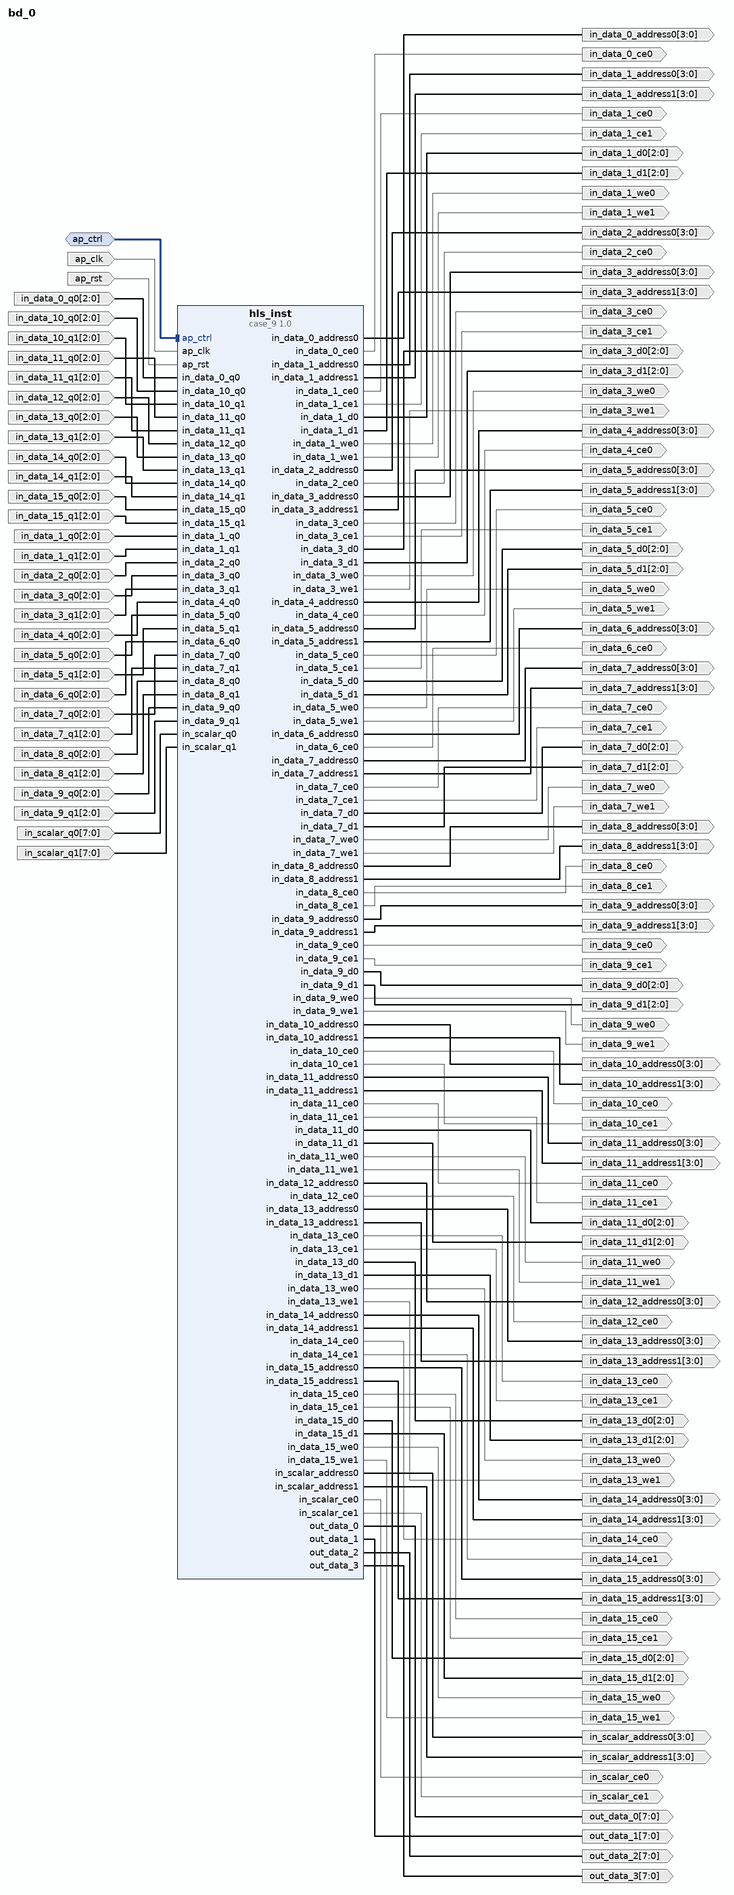
[diagram p0: block diagram of the top level]
# Vivado block design bd_0, xc7z020clg484-1, Vivado 2025.1
create_bd_design bd_0

create_bd_intf_port -mode Slave -vlnv xilinx.com:interface:acc_handshake_rtl:1.0 ap_ctrl
create_bd_port -dir I -type clk ap_clk
set_property -dict {CONFIG.FREQ_HZ 83000000.0} [get_bd_ports ap_clk]
create_bd_port -dir I -type rst ap_rst
set_property -dict {CONFIG.POLARITY ACTIVE_HIGH} [get_bd_ports ap_rst]
create_bd_port -dir O -from 3 -to 0 -type data in_data_0_address0
create_bd_port -dir O in_data_0_ce0
create_bd_port -dir I -from 2 -to 0 -type data in_data_0_q0
create_bd_port -dir O -from 3 -to 0 -type data in_data_10_address0
create_bd_port -dir O -from 3 -to 0 -type data in_data_10_address1
create_bd_port -dir O in_data_10_ce0
create_bd_port -dir O in_data_10_ce1
create_bd_port -dir I -from 2 -to 0 -type data in_data_10_q0
create_bd_port -dir I -from 2 -to 0 -type data in_data_10_q1
create_bd_port -dir O -from 3 -to 0 -type data in_data_11_address0
create_bd_port -dir O -from 3 -to 0 -type data in_data_11_address1
create_bd_port -dir O in_data_11_ce0
create_bd_port -dir O in_data_11_ce1
create_bd_port -dir O -from 2 -to 0 -type data in_data_11_d0
create_bd_port -dir O -from 2 -to 0 -type data in_data_11_d1
create_bd_port -dir I -from 2 -to 0 -type data in_data_11_q0
create_bd_port -dir I -from 2 -to 0 -type data in_data_11_q1
create_bd_port -dir O in_data_11_we0
create_bd_port -dir O in_data_11_we1
create_bd_port -dir O -from 3 -to 0 -type data in_data_12_address0
create_bd_port -dir O in_data_12_ce0
create_bd_port -dir I -from 2 -to 0 -type data in_data_12_q0
create_bd_port -dir O -from 3 -to 0 -type data in_data_13_address0
create_bd_port -dir O -from 3 -to 0 -type data in_data_13_address1
create_bd_port -dir O in_data_13_ce0
create_bd_port -dir O in_data_13_ce1
create_bd_port -dir O -from 2 -to 0 -type data in_data_13_d0
create_bd_port -dir O -from 2 -to 0 -type data in_data_13_d1
create_bd_port -dir I -from 2 -to 0 -type data in_data_13_q0
create_bd_port -dir I -from 2 -to 0 -type data in_data_13_q1
create_bd_port -dir O in_data_13_we0
create_bd_port -dir O in_data_13_we1
create_bd_port -dir O -from 3 -to 0 -type data in_data_14_address0
create_bd_port -dir O -from 3 -to 0 -type data in_data_14_address1
create_bd_port -dir O in_data_14_ce0
create_bd_port -dir O in_data_14_ce1
create_bd_port -dir I -from 2 -to 0 -type data in_data_14_q0
create_bd_port -dir I -from 2 -to 0 -type data in_data_14_q1
create_bd_port -dir O -from 3 -to 0 -type data in_data_15_address0
create_bd_port -dir O -from 3 -to 0 -type data in_data_15_address1
create_bd_port -dir O in_data_15_ce0
create_bd_port -dir O in_data_15_ce1
create_bd_port -dir O -from 2 -to 0 -type data in_data_15_d0
create_bd_port -dir O -from 2 -to 0 -type data in_data_15_d1
create_bd_port -dir I -from 2 -to 0 -type data in_data_15_q0
create_bd_port -dir I -from 2 -to 0 -type data in_data_15_q1
create_bd_port -dir O in_data_15_we0
create_bd_port -dir O in_data_15_we1
create_bd_port -dir O -from 3 -to 0 -type data in_data_1_address0
create_bd_port -dir O -from 3 -to 0 -type data in_data_1_address1
create_bd_port -dir O in_data_1_ce0
create_bd_port -dir O in_data_1_ce1
create_bd_port -dir O -from 2 -to 0 -type data in_data_1_d0
create_bd_port -dir O -from 2 -to 0 -type data in_data_1_d1
create_bd_port -dir I -from 2 -to 0 -type data in_data_1_q0
create_bd_port -dir I -from 2 -to 0 -type data in_data_1_q1
create_bd_port -dir O in_data_1_we0
create_bd_port -dir O in_data_1_we1
create_bd_port -dir O -from 3 -to 0 -type data in_data_2_address0
create_bd_port -dir O in_data_2_ce0
create_bd_port -dir I -from 2 -to 0 -type data in_data_2_q0
create_bd_port -dir O -from 3 -to 0 -type data in_data_3_address0
create_bd_port -dir O -from 3 -to 0 -type data in_data_3_address1
create_bd_port -dir O in_data_3_ce0
create_bd_port -dir O in_data_3_ce1
create_bd_port -dir O -from 2 -to 0 -type data in_data_3_d0
create_bd_port -dir O -from 2 -to 0 -type data in_data_3_d1
create_bd_port -dir I -from 2 -to 0 -type data in_data_3_q0
create_bd_port -dir I -from 2 -to 0 -type data in_data_3_q1
create_bd_port -dir O in_data_3_we0
create_bd_port -dir O in_data_3_we1
create_bd_port -dir O -from 3 -to 0 -type data in_data_4_address0
create_bd_port -dir O in_data_4_ce0
create_bd_port -dir I -from 2 -to 0 -type data in_data_4_q0
create_bd_port -dir O -from 3 -to 0 -type data in_data_5_address0
create_bd_port -dir O -from 3 -to 0 -type data in_data_5_address1
create_bd_port -dir O in_data_5_ce0
create_bd_port -dir O in_data_5_ce1
create_bd_port -dir O -from 2 -to 0 -type data in_data_5_d0
create_bd_port -dir O -from 2 -to 0 -type data in_data_5_d1
create_bd_port -dir I -from 2 -to 0 -type data in_data_5_q0
create_bd_port -dir I -from 2 -to 0 -type data in_data_5_q1
create_bd_port -dir O in_data_5_we0
create_bd_port -dir O in_data_5_we1
create_bd_port -dir O -from 3 -to 0 -type data in_data_6_address0
create_bd_port -dir O in_data_6_ce0
create_bd_port -dir I -from 2 -to 0 -type data in_data_6_q0
create_bd_port -dir O -from 3 -to 0 -type data in_data_7_address0
create_bd_port -dir O -from 3 -to 0 -type data in_data_7_address1
create_bd_port -dir O in_data_7_ce0
create_bd_port -dir O in_data_7_ce1
create_bd_port -dir O -from 2 -to 0 -type data in_data_7_d0
create_bd_port -dir O -from 2 -to 0 -type data in_data_7_d1
create_bd_port -dir I -from 2 -to 0 -type data in_data_7_q0
create_bd_port -dir I -from 2 -to 0 -type data in_data_7_q1
create_bd_port -dir O in_data_7_we0
create_bd_port -dir O in_data_7_we1
create_bd_port -dir O -from 3 -to 0 -type data in_data_8_address0
create_bd_port -dir O -from 3 -to 0 -type data in_data_8_address1
create_bd_port -dir O in_data_8_ce0
create_bd_port -dir O in_data_8_ce1
create_bd_port -dir I -from 2 -to 0 -type data in_data_8_q0
create_bd_port -dir I -from 2 -to 0 -type data in_data_8_q1
create_bd_port -dir O -from 3 -to 0 -type data in_data_9_address0
create_bd_port -dir O -from 3 -to 0 -type data in_data_9_address1
create_bd_port -dir O in_data_9_ce0
create_bd_port -dir O in_data_9_ce1
create_bd_port -dir O -from 2 -to 0 -type data in_data_9_d0
create_bd_port -dir O -from 2 -to 0 -type data in_data_9_d1
create_bd_port -dir I -from 2 -to 0 -type data in_data_9_q0
create_bd_port -dir I -from 2 -to 0 -type data in_data_9_q1
create_bd_port -dir O in_data_9_we0
create_bd_port -dir O in_data_9_we1
create_bd_port -dir O -from 3 -to 0 -type data in_scalar_address0
create_bd_port -dir O -from 3 -to 0 -type data in_scalar_address1
create_bd_port -dir O in_scalar_ce0
create_bd_port -dir O in_scalar_ce1
create_bd_port -dir I -from 7 -to 0 -type data in_scalar_q0
create_bd_port -dir I -from 7 -to 0 -type data in_scalar_q1
create_bd_port -dir O -from 7 -to 0 -type data out_data_0
create_bd_port -dir O -from 7 -to 0 -type data out_data_1
create_bd_port -dir O -from 7 -to 0 -type data out_data_2
create_bd_port -dir O -from 7 -to 0 -type data out_data_3

create_bd_cell -type ip -vlnv xilinx.com:hls:case_9:1.0 hls_inst

# ---- connections ----

connect_bd_intf_net -intf_net ap_ctrl_0_1 [get_bd_intf_ports ap_ctrl] [get_bd_intf_pins hls_inst/ap_ctrl]
connect_bd_net -net ap_clk_0_1 [get_bd_ports ap_clk] [get_bd_pins hls_inst/ap_clk]
connect_bd_net -net ap_rst_0_1 [get_bd_ports ap_rst] [get_bd_pins hls_inst/ap_rst]
connect_bd_net [get_bd_pins hls_inst/in_data_0_address0] [get_bd_ports in_data_0_address0]
connect_bd_net [get_bd_pins hls_inst/in_data_0_ce0] [get_bd_ports in_data_0_ce0]
connect_bd_net [get_bd_pins hls_inst/in_data_10_address0] [get_bd_ports in_data_10_address0]
connect_bd_net [get_bd_pins hls_inst/in_data_10_address1] [get_bd_ports in_data_10_address1]
connect_bd_net [get_bd_pins hls_inst/in_data_10_ce0] [get_bd_ports in_data_10_ce0]
connect_bd_net [get_bd_pins hls_inst/in_data_10_ce1] [get_bd_ports in_data_10_ce1]
connect_bd_net [get_bd_pins hls_inst/in_data_11_address0] [get_bd_ports in_data_11_address0]
connect_bd_net [get_bd_pins hls_inst/in_data_11_address1] [get_bd_ports in_data_11_address1]
connect_bd_net [get_bd_pins hls_inst/in_data_11_ce0] [get_bd_ports in_data_11_ce0]
connect_bd_net [get_bd_pins hls_inst/in_data_11_ce1] [get_bd_ports in_data_11_ce1]
connect_bd_net [get_bd_pins hls_inst/in_data_11_d0] [get_bd_ports in_data_11_d0]
connect_bd_net [get_bd_pins hls_inst/in_data_11_d1] [get_bd_ports in_data_11_d1]
connect_bd_net [get_bd_pins hls_inst/in_data_11_we0] [get_bd_ports in_data_11_we0]
connect_bd_net [get_bd_pins hls_inst/in_data_11_we1] [get_bd_ports in_data_11_we1]
connect_bd_net [get_bd_pins hls_inst/in_data_12_address0] [get_bd_ports in_data_12_address0]
connect_bd_net [get_bd_pins hls_inst/in_data_12_ce0] [get_bd_ports in_data_12_ce0]
connect_bd_net [get_bd_pins hls_inst/in_data_13_address0] [get_bd_ports in_data_13_address0]
connect_bd_net [get_bd_pins hls_inst/in_data_13_address1] [get_bd_ports in_data_13_address1]
connect_bd_net [get_bd_pins hls_inst/in_data_13_ce0] [get_bd_ports in_data_13_ce0]
connect_bd_net [get_bd_pins hls_inst/in_data_13_ce1] [get_bd_ports in_data_13_ce1]
connect_bd_net [get_bd_pins hls_inst/in_data_13_d0] [get_bd_ports in_data_13_d0]
connect_bd_net [get_bd_pins hls_inst/in_data_13_d1] [get_bd_ports in_data_13_d1]
connect_bd_net [get_bd_pins hls_inst/in_data_13_we0] [get_bd_ports in_data_13_we0]
connect_bd_net [get_bd_pins hls_inst/in_data_13_we1] [get_bd_ports in_data_13_we1]
connect_bd_net [get_bd_pins hls_inst/in_data_14_address0] [get_bd_ports in_data_14_address0]
connect_bd_net [get_bd_pins hls_inst/in_data_14_address1] [get_bd_ports in_data_14_address1]
connect_bd_net [get_bd_pins hls_inst/in_data_14_ce0] [get_bd_ports in_data_14_ce0]
connect_bd_net [get_bd_pins hls_inst/in_data_14_ce1] [get_bd_ports in_data_14_ce1]
connect_bd_net [get_bd_pins hls_inst/in_data_15_address0] [get_bd_ports in_data_15_address0]
connect_bd_net [get_bd_pins hls_inst/in_data_15_address1] [get_bd_ports in_data_15_address1]
connect_bd_net [get_bd_pins hls_inst/in_data_15_ce0] [get_bd_ports in_data_15_ce0]
connect_bd_net [get_bd_pins hls_inst/in_data_15_ce1] [get_bd_ports in_data_15_ce1]
connect_bd_net [get_bd_pins hls_inst/in_data_15_d0] [get_bd_ports in_data_15_d0]
connect_bd_net [get_bd_pins hls_inst/in_data_15_d1] [get_bd_ports in_data_15_d1]
connect_bd_net [get_bd_pins hls_inst/in_data_15_we0] [get_bd_ports in_data_15_we0]
connect_bd_net [get_bd_pins hls_inst/in_data_15_we1] [get_bd_ports in_data_15_we1]
connect_bd_net [get_bd_pins hls_inst/in_data_1_address0] [get_bd_ports in_data_1_address0]
connect_bd_net [get_bd_pins hls_inst/in_data_1_address1] [get_bd_ports in_data_1_address1]
connect_bd_net [get_bd_pins hls_inst/in_data_1_ce0] [get_bd_ports in_data_1_ce0]
connect_bd_net [get_bd_pins hls_inst/in_data_1_ce1] [get_bd_ports in_data_1_ce1]
connect_bd_net [get_bd_pins hls_inst/in_data_1_d0] [get_bd_ports in_data_1_d0]
connect_bd_net [get_bd_pins hls_inst/in_data_1_d1] [get_bd_ports in_data_1_d1]
connect_bd_net [get_bd_pins hls_inst/in_data_1_we0] [get_bd_ports in_data_1_we0]
connect_bd_net [get_bd_pins hls_inst/in_data_1_we1] [get_bd_ports in_data_1_we1]
connect_bd_net [get_bd_pins hls_inst/in_data_2_address0] [get_bd_ports in_data_2_address0]
connect_bd_net [get_bd_pins hls_inst/in_data_2_ce0] [get_bd_ports in_data_2_ce0]
connect_bd_net [get_bd_pins hls_inst/in_data_3_address0] [get_bd_ports in_data_3_address0]
connect_bd_net [get_bd_pins hls_inst/in_data_3_address1] [get_bd_ports in_data_3_address1]
connect_bd_net [get_bd_pins hls_inst/in_data_3_ce0] [get_bd_ports in_data_3_ce0]
connect_bd_net [get_bd_pins hls_inst/in_data_3_ce1] [get_bd_ports in_data_3_ce1]
connect_bd_net [get_bd_pins hls_inst/in_data_3_d0] [get_bd_ports in_data_3_d0]
connect_bd_net [get_bd_pins hls_inst/in_data_3_d1] [get_bd_ports in_data_3_d1]
connect_bd_net [get_bd_pins hls_inst/in_data_3_we0] [get_bd_ports in_data_3_we0]
connect_bd_net [get_bd_pins hls_inst/in_data_3_we1] [get_bd_ports in_data_3_we1]
connect_bd_net [get_bd_pins hls_inst/in_data_4_address0] [get_bd_ports in_data_4_address0]
connect_bd_net [get_bd_pins hls_inst/in_data_4_ce0] [get_bd_ports in_data_4_ce0]
connect_bd_net [get_bd_pins hls_inst/in_data_5_address0] [get_bd_ports in_data_5_address0]
connect_bd_net [get_bd_pins hls_inst/in_data_5_address1] [get_bd_ports in_data_5_address1]
connect_bd_net [get_bd_pins hls_inst/in_data_5_ce0] [get_bd_ports in_data_5_ce0]
connect_bd_net [get_bd_pins hls_inst/in_data_5_ce1] [get_bd_ports in_data_5_ce1]
connect_bd_net [get_bd_pins hls_inst/in_data_5_d0] [get_bd_ports in_data_5_d0]
connect_bd_net [get_bd_pins hls_inst/in_data_5_d1] [get_bd_ports in_data_5_d1]
connect_bd_net [get_bd_pins hls_inst/in_data_5_we0] [get_bd_ports in_data_5_we0]
connect_bd_net [get_bd_pins hls_inst/in_data_5_we1] [get_bd_ports in_data_5_we1]
connect_bd_net [get_bd_pins hls_inst/in_data_6_address0] [get_bd_ports in_data_6_address0]
connect_bd_net [get_bd_pins hls_inst/in_data_6_ce0] [get_bd_ports in_data_6_ce0]
connect_bd_net [get_bd_pins hls_inst/in_data_7_address0] [get_bd_ports in_data_7_address0]
connect_bd_net [get_bd_pins hls_inst/in_data_7_address1] [get_bd_ports in_data_7_address1]
connect_bd_net [get_bd_pins hls_inst/in_data_7_ce0] [get_bd_ports in_data_7_ce0]
connect_bd_net [get_bd_pins hls_inst/in_data_7_ce1] [get_bd_ports in_data_7_ce1]
connect_bd_net [get_bd_pins hls_inst/in_data_7_d0] [get_bd_ports in_data_7_d0]
connect_bd_net [get_bd_pins hls_inst/in_data_7_d1] [get_bd_ports in_data_7_d1]
connect_bd_net [get_bd_pins hls_inst/in_data_7_we0] [get_bd_ports in_data_7_we0]
connect_bd_net [get_bd_pins hls_inst/in_data_7_we1] [get_bd_ports in_data_7_we1]
connect_bd_net [get_bd_pins hls_inst/in_data_8_address0] [get_bd_ports in_data_8_address0]
connect_bd_net [get_bd_pins hls_inst/in_data_8_address1] [get_bd_ports in_data_8_address1]
connect_bd_net [get_bd_pins hls_inst/in_data_8_ce0] [get_bd_ports in_data_8_ce0]
connect_bd_net [get_bd_pins hls_inst/in_data_8_ce1] [get_bd_ports in_data_8_ce1]
connect_bd_net [get_bd_pins hls_inst/in_data_9_address0] [get_bd_ports in_data_9_address0]
connect_bd_net [get_bd_pins hls_inst/in_data_9_address1] [get_bd_ports in_data_9_address1]
connect_bd_net [get_bd_pins hls_inst/in_data_9_ce0] [get_bd_ports in_data_9_ce0]
connect_bd_net [get_bd_pins hls_inst/in_data_9_ce1] [get_bd_ports in_data_9_ce1]
connect_bd_net [get_bd_pins hls_inst/in_data_9_d0] [get_bd_ports in_data_9_d0]
connect_bd_net [get_bd_pins hls_inst/in_data_9_d1] [get_bd_ports in_data_9_d1]
connect_bd_net [get_bd_pins hls_inst/in_data_9_we0] [get_bd_ports in_data_9_we0]
connect_bd_net [get_bd_pins hls_inst/in_data_9_we1] [get_bd_ports in_data_9_we1]
connect_bd_net [get_bd_pins hls_inst/in_scalar_address0] [get_bd_ports in_scalar_address0]
connect_bd_net [get_bd_pins hls_inst/in_scalar_address1] [get_bd_ports in_scalar_address1]
connect_bd_net [get_bd_pins hls_inst/in_scalar_ce0] [get_bd_ports in_scalar_ce0]
connect_bd_net [get_bd_pins hls_inst/in_scalar_ce1] [get_bd_ports in_scalar_ce1]
connect_bd_net [get_bd_pins hls_inst/out_data_0] [get_bd_ports out_data_0]
connect_bd_net [get_bd_pins hls_inst/out_data_1] [get_bd_ports out_data_1]
connect_bd_net [get_bd_pins hls_inst/out_data_2] [get_bd_ports out_data_2]
connect_bd_net [get_bd_pins hls_inst/out_data_3] [get_bd_ports out_data_3]
connect_bd_net -net in_data_0_q0_0_1 [get_bd_ports in_data_0_q0] [get_bd_pins hls_inst/in_data_0_q0]
connect_bd_net -net in_data_10_q0_0_1 [get_bd_ports in_data_10_q0] [get_bd_pins hls_inst/in_data_10_q0]
connect_bd_net -net in_data_10_q1_0_1 [get_bd_ports in_data_10_q1] [get_bd_pins hls_inst/in_data_10_q1]
connect_bd_net -net in_data_11_q0_0_1 [get_bd_ports in_data_11_q0] [get_bd_pins hls_inst/in_data_11_q0]
connect_bd_net -net in_data_11_q1_0_1 [get_bd_ports in_data_11_q1] [get_bd_pins hls_inst/in_data_11_q1]
connect_bd_net -net in_data_12_q0_0_1 [get_bd_ports in_data_12_q0] [get_bd_pins hls_inst/in_data_12_q0]
connect_bd_net -net in_data_13_q0_0_1 [get_bd_ports in_data_13_q0] [get_bd_pins hls_inst/in_data_13_q0]
connect_bd_net -net in_data_13_q1_0_1 [get_bd_ports in_data_13_q1] [get_bd_pins hls_inst/in_data_13_q1]
connect_bd_net -net in_data_14_q0_0_1 [get_bd_ports in_data_14_q0] [get_bd_pins hls_inst/in_data_14_q0]
connect_bd_net -net in_data_14_q1_0_1 [get_bd_ports in_data_14_q1] [get_bd_pins hls_inst/in_data_14_q1]
connect_bd_net -net in_data_15_q0_0_1 [get_bd_ports in_data_15_q0] [get_bd_pins hls_inst/in_data_15_q0]
connect_bd_net -net in_data_15_q1_0_1 [get_bd_ports in_data_15_q1] [get_bd_pins hls_inst/in_data_15_q1]
connect_bd_net -net in_data_1_q0_0_1 [get_bd_ports in_data_1_q0] [get_bd_pins hls_inst/in_data_1_q0]
connect_bd_net -net in_data_1_q1_0_1 [get_bd_ports in_data_1_q1] [get_bd_pins hls_inst/in_data_1_q1]
connect_bd_net -net in_data_2_q0_0_1 [get_bd_ports in_data_2_q0] [get_bd_pins hls_inst/in_data_2_q0]
connect_bd_net -net in_data_3_q0_0_1 [get_bd_ports in_data_3_q0] [get_bd_pins hls_inst/in_data_3_q0]
connect_bd_net -net in_data_3_q1_0_1 [get_bd_ports in_data_3_q1] [get_bd_pins hls_inst/in_data_3_q1]
connect_bd_net -net in_data_4_q0_0_1 [get_bd_ports in_data_4_q0] [get_bd_pins hls_inst/in_data_4_q0]
connect_bd_net -net in_data_5_q0_0_1 [get_bd_ports in_data_5_q0] [get_bd_pins hls_inst/in_data_5_q0]
connect_bd_net -net in_data_5_q1_0_1 [get_bd_ports in_data_5_q1] [get_bd_pins hls_inst/in_data_5_q1]
connect_bd_net -net in_data_6_q0_0_1 [get_bd_ports in_data_6_q0] [get_bd_pins hls_inst/in_data_6_q0]
connect_bd_net -net in_data_7_q0_0_1 [get_bd_ports in_data_7_q0] [get_bd_pins hls_inst/in_data_7_q0]
connect_bd_net -net in_data_7_q1_0_1 [get_bd_ports in_data_7_q1] [get_bd_pins hls_inst/in_data_7_q1]
connect_bd_net -net in_data_8_q0_0_1 [get_bd_ports in_data_8_q0] [get_bd_pins hls_inst/in_data_8_q0]
connect_bd_net -net in_data_8_q1_0_1 [get_bd_ports in_data_8_q1] [get_bd_pins hls_inst/in_data_8_q1]
connect_bd_net -net in_data_9_q0_0_1 [get_bd_ports in_data_9_q0] [get_bd_pins hls_inst/in_data_9_q0]
connect_bd_net -net in_data_9_q1_0_1 [get_bd_ports in_data_9_q1] [get_bd_pins hls_inst/in_data_9_q1]
connect_bd_net -net in_scalar_q0_0_1 [get_bd_ports in_scalar_q0] [get_bd_pins hls_inst/in_scalar_q0]
connect_bd_net -net in_scalar_q1_0_1 [get_bd_ports in_scalar_q1] [get_bd_pins hls_inst/in_scalar_q1]

validate_bd_design
save_bd_design
